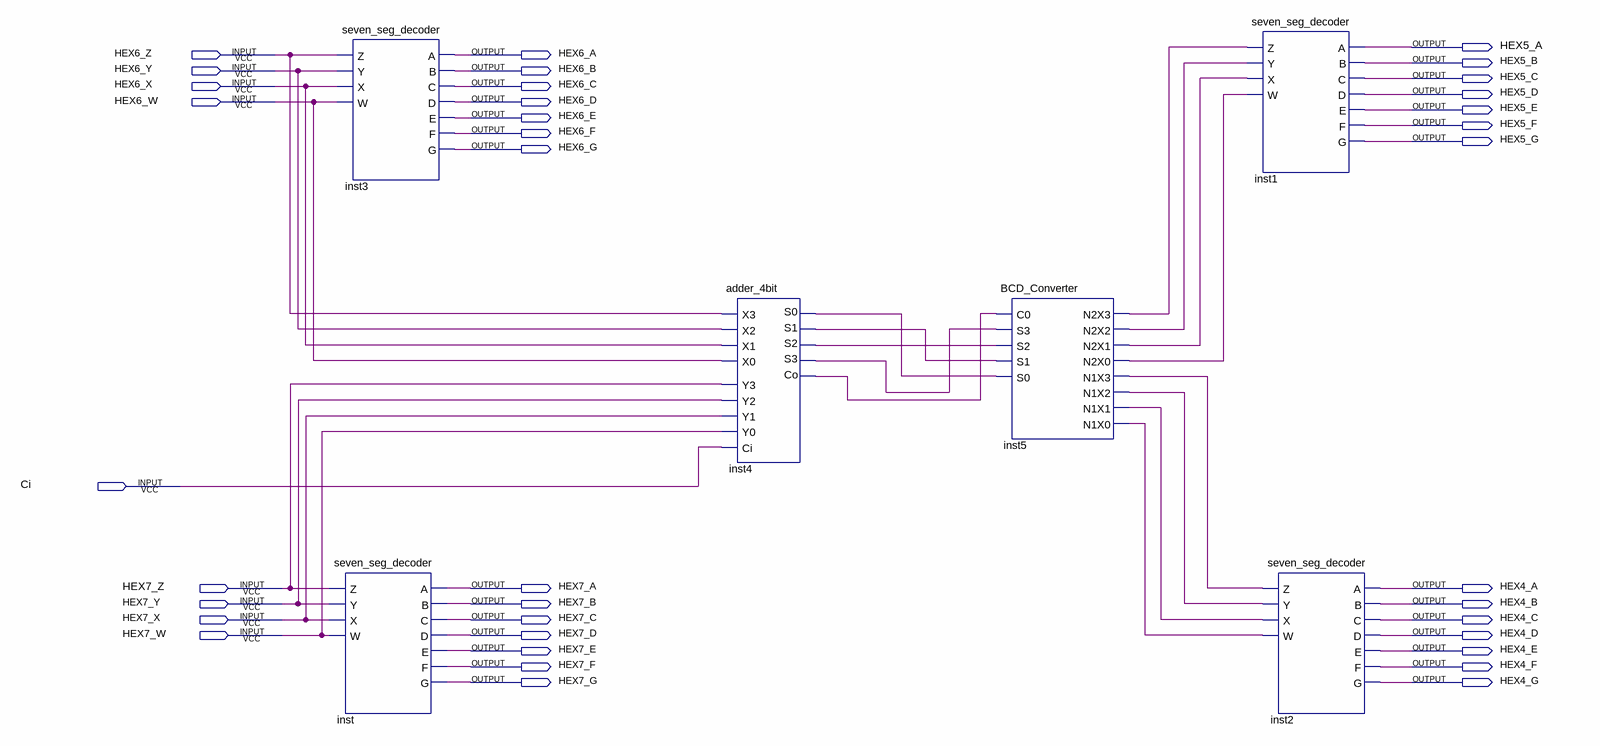
[diagram p0: schematic sheet]
// Quartus schematic lab6step1.bdf as structural Verilog: 6 symbols, 37 pins
module lab6step1 (
  input  HEX6_Z,
  input  HEX6_Y,
  input  HEX6_X,
  input  HEX6_W,
  input  Ci,
  input  HEX7_Z,
  input  HEX7_Y,
  input  HEX7_X,
  input  HEX7_W,
  output HEX5_A,
  output HEX6_A,
  output HEX5_B,
  output HEX6_B,
  output HEX5_C,
  output HEX6_C,
  output HEX5_D,
  output HEX6_D,
  output HEX5_E,
  output HEX6_E,
  output HEX5_F,
  output HEX6_F,
  output HEX5_G,
  output HEX6_G,
  output HEX7_A,
  output HEX4_A,
  output HEX7_B,
  output HEX4_B,
  output HEX7_C,
  output HEX4_C,
  output HEX7_D,
  output HEX4_D,
  output HEX7_E,
  output HEX4_E,
  output HEX7_F,
  output HEX4_F,
  output HEX7_G,
  output HEX4_G
);

  wire inst4_co, inst4_s0, inst4_s1, inst4_s2, inst4_s3, inst5_n1x0, inst5_n1x1, inst5_n1x2, inst5_n1x3,
       inst5_n2x0, inst5_n2x1, inst5_n2x2, inst5_n2x3;

  seven_seg_decoder inst3 (
    .Z(HEX6_Z), .Y(HEX6_Y), .X(HEX6_X), .W(HEX6_W), .A(HEX6_A), .B(HEX6_B), .C(HEX6_C), .D(HEX6_D),
    .E(HEX6_E), .F(HEX6_F), .G(HEX6_G));
  seven_seg_decoder inst (
    .Z(HEX7_Z), .Y(HEX7_Y), .X(HEX7_X), .W(HEX7_W), .A(HEX7_A), .B(HEX7_B), .C(HEX7_C), .D(HEX7_D),
    .E(HEX7_E), .F(HEX7_F), .G(HEX7_G));
  adder_4bit inst4 (
    .X3(HEX6_Z), .Y3(HEX7_Z), .X2(HEX6_Y), .Y2(HEX7_Y), .X1(HEX6_X), .Y1(HEX7_X), .X0(HEX6_W), .Y0(HEX7_W),
    .Ci(Ci), .S0(inst4_s0), .S1(inst4_s1), .S2(inst4_s2), .S3(inst4_s3), .Co(inst4_co));
  BCD_Converter inst5 (
    .C0(inst4_co), .S3(inst4_s3), .S2(inst4_s2), .S1(inst4_s1), .S0(inst4_s0), .N2X3(inst5_n2x3),
    .N2X2(inst5_n2x2), .N2X1(inst5_n2x1), .N2X0(inst5_n2x0), .N1X3(inst5_n1x3), .N1X2(inst5_n1x2),
    .N1X1(inst5_n1x1), .N1X0(inst5_n1x0));
  seven_seg_decoder inst1 (
    .Z(inst5_n2x3), .Y(inst5_n2x2), .X(inst5_n2x1), .W(inst5_n2x0), .A(HEX5_A), .B(HEX5_B), .C(HEX5_C),
    .D(HEX5_D), .E(HEX5_E), .F(HEX5_F), .G(HEX5_G));
  seven_seg_decoder inst2 (
    .Z(inst5_n1x3), .Y(inst5_n1x2), .X(inst5_n1x1), .W(inst5_n1x0), .A(HEX4_A), .B(HEX4_B), .C(HEX4_C),
    .D(HEX4_D), .E(HEX4_E), .F(HEX4_F), .G(HEX4_G));
endmodule
